# EAGLE design Adafruit Grayscale 1.5-inch 128x128 OLED (EAGLE 9.6.2)
COMPANY: ADAFRUIT INDUSTRIES; DRAWN: KTOWN; REV: A
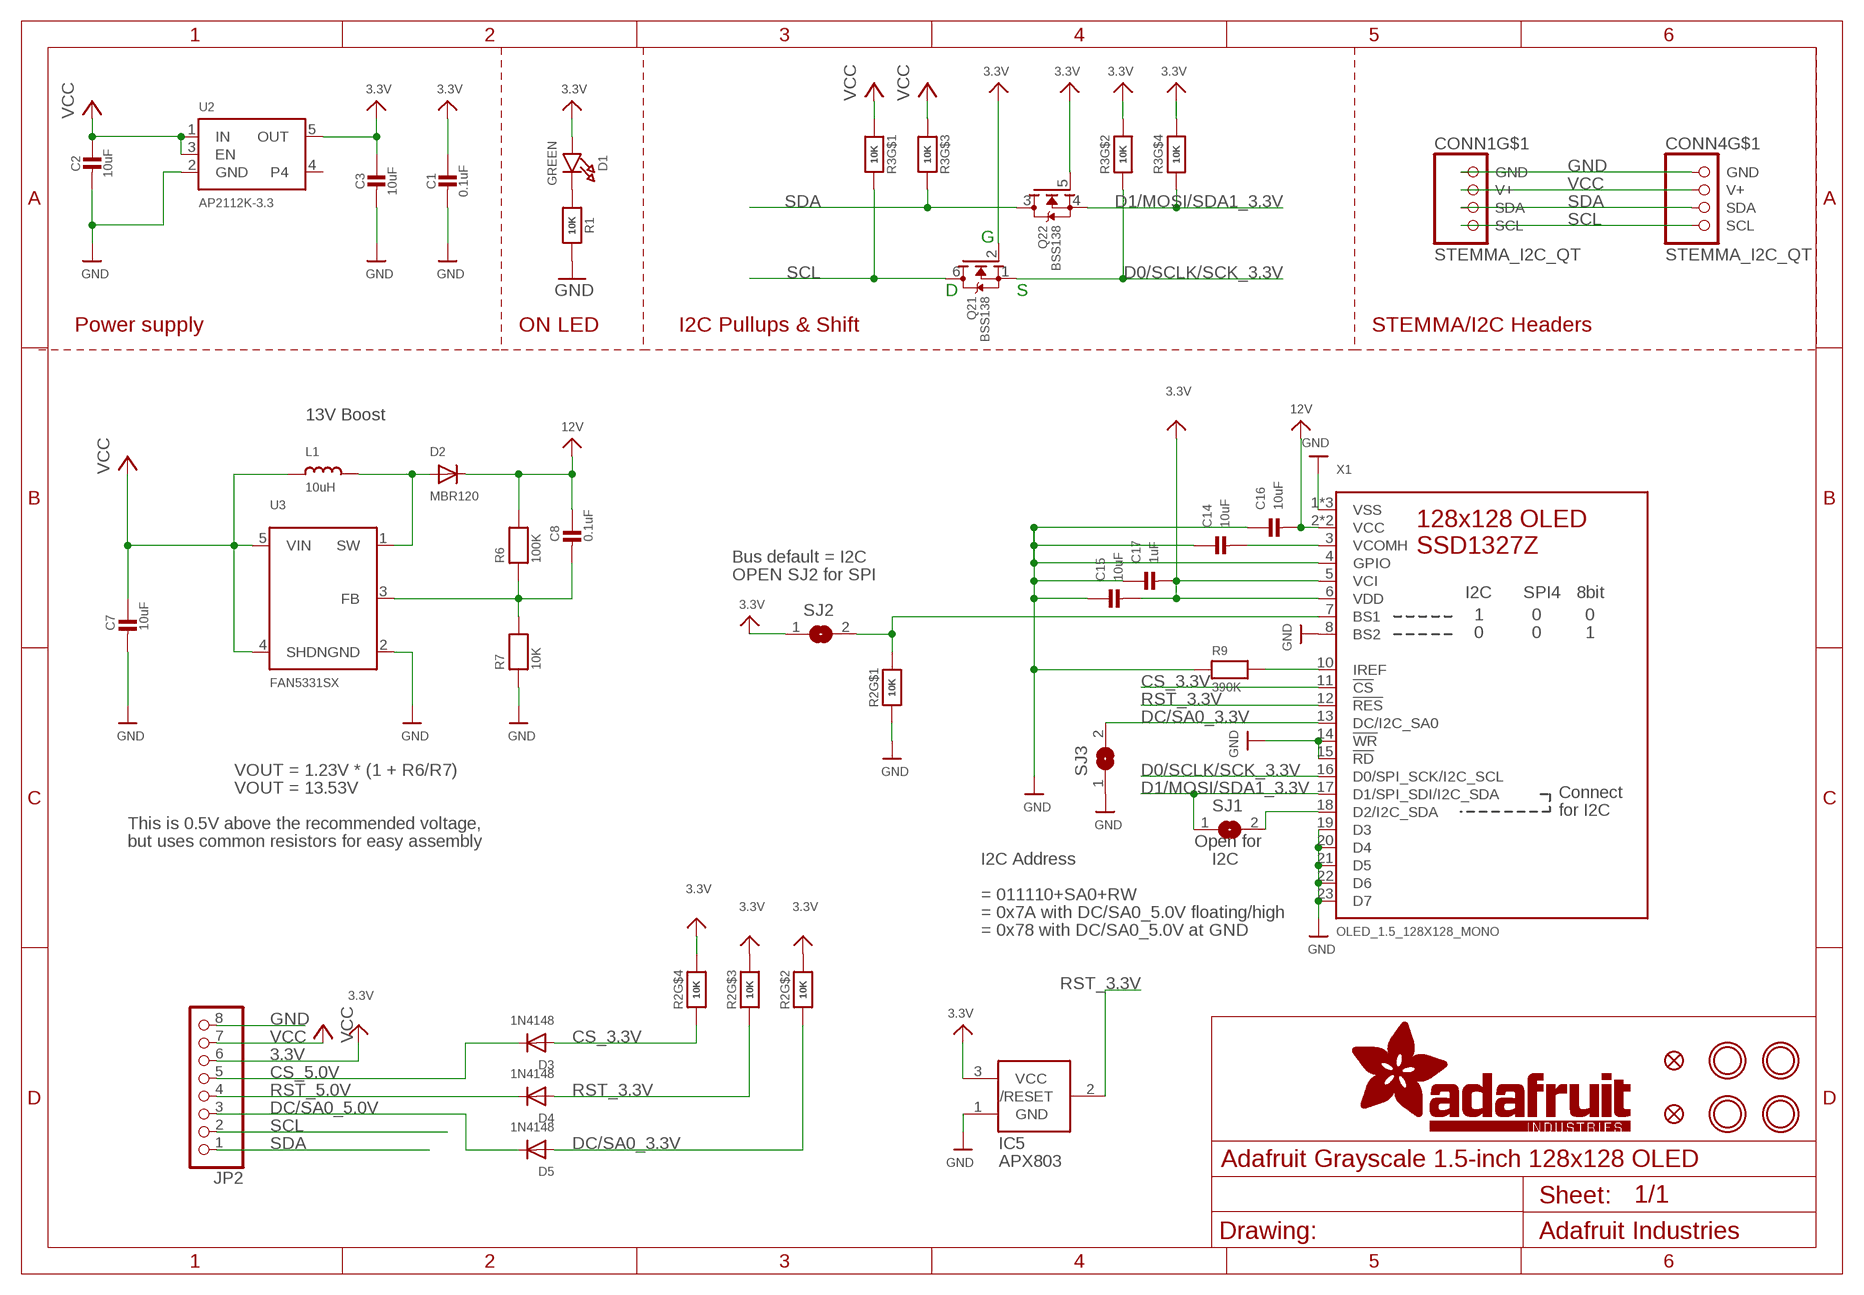
[diagram p0: schematic, sheet 1]

## Parts
C1  0.1uF  CAP_CERAMIC0603_NO  [0603-NO]
C2  10uF  CAP_CERAMIC0805-NOOUTLINE  [0805-NO]
C3  10uF  CAP_CERAMIC0805-NOOUTLINE  [0805-NO]
C7  10uF  CAP_CERAMIC0805-NOOUTLINE  [0805-NO]
C8  0.1uF  CAP_CERAMIC0603_NO  [0603-NO]
C14  10uF  CAP_CERAMIC0805-NOOUTLINE  [0805-NO]
C15  10uF  CAP_CERAMIC0805-NOOUTLINE  [0805-NO]
C16  10uF  CAP_CERAMIC0805-NOOUTLINE  [0805-NO]
C17  1uF  CAP_CERAMIC0603_NO  [0603-NO]
CONN1  STEMMA_I2C_QT  [JST_SH4]
CONN4  STEMMA_I2C_QT  [JST_SH4]
D1  GREEN  LED0603_NOOUTLINE  [CHIPLED_0603_NOOUTLINE]
D2  MBR120  DIODESOD-123  [SOD-123]
D3  1N4148  DIODESOD-323  [SOD-323]
D4  1N4148  DIODESOD-323  [SOD-323]
D5  1N4148  DIODESOD-323  [SOD-323]
FID3  FIDUCIAL_1MM  [FIDUCIAL_1MM]
FID4  FIDUCIAL_1MM  [FIDUCIAL_1MM]
IC5  APX803  AXP083-SAG  [SOT23]
JP2  HEADER-1X870MIL  [1X08_ROUND_70]
L1  10uH  INDUCTOR  [INDUCTOR_1007]
Q2  BSS138  MOSFET-N_DUAL  [SOT363]
R1  10K  RESISTOR_0603_NOOUT  [0603-NO]
R2  10K  RESISTOR_4PACK  [RESPACK_4X0603]
R3  10K  RESISTOR_4PACK  [RESPACK_4X0603]
R6  100K  RESISTOR_0603_NOOUT  [0603-NO]
R7  10K  RESISTOR_0603_NOOUT  [0603-NO]
R9  390K  RESISTOR_0603_NOOUT  [0603-NO]
SJ1  SOLDERJUMPERCLOSED  [SOLDERJUMPER_CLOSEDWIRE]
SJ2  SOLDERJUMPERCLOSED  [SOLDERJUMPER_CLOSEDWIRE]
SJ3  SOLDERJUMPER  [SOLDERJUMPER_ARROW_NOPASTE]
U2  AP2112K-3.3  VREG_SOT23-5  [SOT23-5]
U3  FAN5331SX  FAN5331  [SOT23-5@1]
U$1  MOUNTINGHOLE2.5  [MOUNTINGHOLE_2.5_PLATED]
U$17  MOUNTINGHOLE2.5  [MOUNTINGHOLE_2.5_PLATED]
U$19  MOUNTINGHOLE2.5  [MOUNTINGHOLE_2.5_PLATED]
U$21  MOUNTINGHOLE2.5  [MOUNTINGHOLE_2.5_PLATED]
X1  OLED_1.5_128X128_MONO  [OLED_1.5IN_128X128MONO]

## Nets
3.3V: C1.1 C3.1 C15.2 C17.2 D1.A IC5.3(VCC) JP2.6 Q2.2(1:G) Q2.5(2:G) R2.5 R2.6 R2.7 R3.2 R3.4 SJ2.1 U2.5(OUT) X1.5(VCI) X1.6(VDD)
12V: C8.1 C16.2 D2.C R6.2 X1.2(VCC) X1.24(VCC)
CS_3.3V: D3.A R2.4 X1.11(!CS)
CS_5.0V: D3.C JP2.5
D0/SCLK/SCK_3.3V: Q2.1(1:S) R3.7 X1.16(D0/SPI_SCK/I2C_SCL)
D1/MOSI/SDA1_3.3V: Q2.4(2:S) R3.5 SJ1.1 X1.17(D1/SPI_SDI/I2C_SDA)
DC/SA0_3.3V: D5.A R2.2 SJ3.2 X1.13(DC/I2C_SA0)
DC/SA0_5.0V: D5.C JP2.3
GND: C1.2 C2.2 C3.2 C7.2 C14.1 C15.1 C16.1 C17.1 CONN1.1(GND) CONN4.1(GND) IC5.1(GND) JP2.8 R1.2 R2.1 R7.1 R9.1 SJ3.1 U2.2(GND) U3.2(GND) X1.1(VSS) X1.4(GPIO) X1.8(BS2) X1.9(VSS) X1.14(!WR) X1.15(!RD) X1.19(D3) X1.20(D4) X1.21(D5) X1.22(D6) X1.23(D7) X1.25(VSS)
N$2: D1.C R1.1
N$5: D2.A L1.P$2 U3.1(SW)
N$8: C8.2 R6.1 R7.2 U3.3(FB)
N$9: R2.8 SJ2.2 X1.7(BS1)
N$10: R9.2 X1.10(IREF)
N$15: C14.2 X1.3(VCOMH)
N$17: SJ1.2 X1.18(D2/I2C_SDA)
RST_3.3V: D4.A IC5.2(/RESET) R2.3 X1.12(!RES)
RST_5.0V: D4.C JP2.4
SCL: CONN1.4(SCL) CONN4.4(SCL) JP2.2 Q2.6(1:D) R3.8
SDA: CONN1.3(SDA) CONN4.3(SDA) JP2.1 Q2.3(2:D) R3.6
VCC: C2.1 C7.1 CONN1.2(V+) CONN4.2(V+) JP2.7 L1.P$1 R3.1 R3.3 U2.1(IN) U2.3(EN) U3.4(SHDN) U3.5(VIN)
Unconnected: CONN1.MT1(MT) CONN1.MT2(MT) CONN4.MT1(MT) CONN4.MT2(MT) U2.4

## Notes on the sheet
- G
- D | S
- Power supply | ON LED | I2C Pullups & Shift | STEMMA/I2C Headers
- 13V Boost
- Bus default = I2C
- OPEN SJ2 for SPI
- VOUT = 1.23V * (1 + R6/R7)
- VOUT = 13.53V
- This is 0.5V above the recommended voltage,
- but uses common resistors for easy assembly | Open for
- I2C Address | I2C
- = 011110+SA0+RW
- = 0x7A with DC/SA0_5.0V floating/high
- = 0x78 with DC/SA0_5.0V at GND

## Library data of the parts
C1-C3 C7 C8 C14-C17 = microbuilder:CAP_CERAMIC: Ceramic Capacitors For new designs, use the packages preceded by an '_' character since they are more reliable: The following footprints should be used on most boards: _0402 - Standard footprint for regular board layouts _0603 - Standard footprint for regular board layouts _0805 - Standard footprint for regular board layouts _1206 - Standard footprint for regular board layouts For extremely tight-pitch boards where space is at a premium, the following 'micro-pitch' footprints can be used (smaller pads, no silkscreen outline, etc.): _0402MP - Micro-pitch footprint for very dense/compact boards _0603MP - Micro-pitch footprint for very dense/compact boards _0805MP - Micro-pitch footprint for very dense/compact boards _1206MP - Micro-pitch footprint for very dense/compact boards
CONN1 CONN4 = microbuilder:STEMMA_I2C
D1 = microbuilder:LED: LED 0603 - 0603 Surface Mount Package 2mA: Green LED - Low Power (3.9mcd, 2ma, 1.7Vf) - Digikey: 475-2709-2-ND Orange LED - Low Power (9.8mcd, 2ma, 1.8Vf) - Digikey: 475-1194-2-ND Red LED - Low Power (5mcd, 2ma, 1.8Vf) - Digikey: 475-1195-2-ND Yellow LED - Low Power (7mcd, 2ma, 1.8Vf) - Digikey: 475-1196-2-ND 5mA: Blue LED - Low Power (17mcd, 5ma, 2.9Vf) - Digikey: LNJ937W8CRACT-ND 0805 - 0805 Surface Mount Package 2mA: Red LED (8.8mcd, 2mA, 1.8Vf, Clear) - Low Power [Digikey: 475-2510-1-ND] Green LED (5mcd, 2mA, 1.8Vf, Clear) - Low Power [Digikey: 475-2730-1-ND] Yellow LED (11.3mcd, 2mA, 1.8Vf, Clear) - Low Power [Digikey: 475-2555-1-ND] 20mA: Red LED (104mcd, 20mA, Diffused) - LS R976 [Digikey: 475-1278-6-ND] Red LED (12mcd, 20mA, 2.0Vf, Clear) - APT2012EC [Digikey: 754-1128-1-ND] Green LED (15mcd, 20mA, 2.2Vf, Clear) - APT2012GC [Digikey: 754-1131-1-ND] Orange LED (160mcd, 20mA, 2.1Vf, Clear) - APT2012SECK [Digikey: 754-1130-1-ND] 1206 - 1206 Surface Mount Package Green LED (26mcd, 20mA, Diffused) - LG N971 [Digikey: 475-1407-6-ND] Red LED (15mcd, 20mA, Diffused) - LH N974 [Digikey: 475-1416-6-ND] Cree - Cree High-Power Surface Mount LEDs XPEBWT-L1-0000-00D50 - White 111lm 350mA 2.9Vf 6200K 110° XTEAWT-00-0000-00000LEE3 - White 114lm 350mA 2.85Vf 5000K 115° Everlight - Everlight 45-21 Series Surface Mount LEDs 45-21/QK2C-B2832AC2CB2/2T - Warm White 2000mcd 20mA 3.25Vf 3050K 120° 45-21/LK2C-B38452C4CB2/2T - Nuetral White 2000mcd 20mA 3.25Vf 4150K 120° 45-21/LK2C-B50634C6CB2/2T - Cold White 2200mcd 20mA 3.25Vf 5650K 120° PLCC2 Reverse Mount LS T77K-J1L2-1-0-2-R18-Z - Red 11.25mcd 2mA 1.8Vf 630nm 120° LO T77K-L1M2-24-Z - Orange 19.6mcd 2mA 1.8Vf 606nm 120° LY T77K-K2M1-26-Z - Yellow 15.7mcd 2mA 1.8Vf 587nm 120°
D2-D5 = microbuilder:DIODE: Diode SMA Model Volts Amps Type Vf Ir Digikey # Notes SSA34-E3 40V 3A Schottky 480mV @ 3A 200uA @ 40V SSA34-E3/61TGITR-ND CDBA120-G 20V 1A Schottky 500mV @ 1A 500uA @ 20V 641-1014-6-ND REEL MBRA210 10V 2A Schottky 350mV @ 2A 700uA @ 10V MBRA210LT3 SOD-123 Model Volts Amps Type Vf Ir Order # Notes BAT54T1G 30V 200mA Schottky 800mV @ 200mA 2uA @ 25V BAT54T1GOSTR-ND B0530W 30V 500mA Schottky 430mV @ 500mA 130uA @ 30V B0530W-FDICT-ND REEL MBR120 20V 1A Schottky 340mV @ 1A MBR120VLSFT1GOSCT-ND SOD-323 Model Volts Amps Type Vf Ir Order # Notes PMEG2005EJ 20V 500mA Schottky 355mV @ 500mA 568-4110-1-ND ZLLS410 10V 570mA Schottky 380mV @ 570mA ZLLS410CT-ND 1N4148WS 75V 150mA Silicon/Simple 1V 1N4148WSFSCT-ND REEL SOD-523 Model Volts Amps Type Vf Ir Order # Notes BAT54XV2 30V 200mA Schottky 0.8V @ 100mA BAT54XV2CT-ND TB751S 30V 30mA Schottky RB751S-40TE61CT-ND SOT23-R/W (R = Solder Paste/Reflow Ovens, W = Hand-Soldering) Model Volts Amps Type Vf Ir Order # Notes BAT54FILM 40V 300mA Schottky 497-7162-1-ND POWERDI-5 Model Volts Amps Type Vf Ir Order # Notes PDS560 60V 5A Schottky 670mV @ 5A 150uA @ 60V PDS560DICT-ND
FID3 FID4 = microbuilder:FIDUCIAL: Fiducial Alignment Points Various fiducial points for machine vision alignment.; BOM: EXCLUDE
IC5 = adafruit:AXP083
JP2 = microbuilder:HEADER-1X8: PIN HEADER
L1 = microbuilder:INDUCTOR: Inductors 0603: 10nH Ceramic Inductor - microwire antenna/RF (Digikey: 712-1434-2-ND) 0805: 560nH Ceramic Inductor - RF (Digikey: 553-1047-1-ND) 270nH Ceramic Inductor - Q = 40@250MHz, +-5%, 1 Ohm DC Resistance (Digikey: 535-10506-2-ND) 1007 (2518 Metric) SMT: 10µH 10% 250mOhm 820mA 1007 Inductor (Digikey: 587-2189-1-ND) 22µH 10% 500mOhm 580mA 1007 Inductor (Digikey: 587-2190-1-ND) 47µH 10% 950mOhm 420mA 1007 Inductor (Digikey: 587-2191-1-ND) 47µH 5% 100mOhm 1A 1008 Inductor (Digikey: 732-1816-1-ND) 5.0x5.0mm (Taiyo Yuden NR5040 Series) 6.8µH 20% 2.3A 64mOhm Inductor (Digikey: 587-2374-2-ND) 5.0x5.0mm (TDK VLC5045 Series) 4.7µH 20% 3.3A 34mOhm Inductor (Digikey: 445-6526-1-ND) 6.8µH 20% 2.7A 46mOhm Inductor (Digikey: 445-6527-1-ND) 6.0x6.0mm (TDK VLC6045 Series) 4.7µH 20% 3.8A 27mOhm Inductor (Digikey: 445-6538-2-ND) 6.8µH 20% 3A 41mOhm Inductor (Digikey: 445-6540-1-ND) 6.2µH 30% 2.2A 45mOhm Inductor (Digikey: SRR5028-6R2YCT-ND) - Not TDK VLC6045 but footprint should match 6.0x6.0mm (TDK SLF6045 Series) 6.8uH 30% 2A 33mOhm Inductor (Digikey: 445-4572-1-ND, Mouser: 810-SLF645T6R8N2R0PF) 6.0x6.0mm (Sumida CDRH5D28 Series) 6.2uH 30% 1.8A 45mOhm Inductor (Digikey: 308-1542-1-ND) Taiyo Yuden NR3015T2R2M - 2.2uH 20% 1.5A (Digikey: 587-1648-2-ND, Mouser: 963-NR3015T2R2M) - Used with TI TPS62172 CoilCraft RFID Transponder Coil - MA5532-AE (For use with AS3935 Lightning Sensor) Taiyo Yuden NRH2412T2R2MNGH - 2.2uH 20% 1AA (Digikey: 587-3443-1-ND) - Used with TI LM3671 Vishay IHLP 1.0uH Molded Inductor - 24mOhm DCR, 5A, +/-20%, -55°C-125°C (Digikey: 541-1319-1-ND)
Q2 = microbuilder:MOSFET-N_DUAL: Dual N-Channel MOSFET SOT363 (2.0x1.25mm) 2N7002PS - 60V, 320mA [Digikey: 568-5984-1-ND]
R1 R6 R7 R9 = microbuilder:RESISTOR: Resistors For new designs, use the packages preceded by an '_' character since they are more reliable: The following footprints should be used on most boards: _0402 - Standard footprint for regular board layouts _0603 - Standard footprint for regular board layouts _0805 - Standard footprint for regular board layouts _1206 - Standard footprint for regular board layouts For extremely tight-pitch boards where space is at a premium, the following 'micro-pitch' footprints can be used (smaller pads, no silkscreen outline, etc.): _0402MP - Micro-pitch footprint for very dense/compact boards _0603MP - Micro-pitch footprint for very dense/compact boards _0805MP - Micro-pitch footprint for very dense/compact boards _1206MP - Micro-pitch footprint for very dense/compact boards
R2 R3 = microbuilder:RESISTOR_4PACK: Resistor Packs (4 resistors) 4 x 0603 10K 1/16W - Digikey: YC164J-10KCT-ND
SJ1 SJ2 = microbuilder:SOLDERJUMPER: SMD Solder JUMPER Solder the two pads together to create a connection, or remove the solder to break it. REFLOW - Use this footprint for solder paste and reflow ovens. WAVE - Use this footprint for hand-soldering (larger pads). CLOSED - Has a trace between the two pads to ensure it is closed by default. The trace needs to be cut to disable the jumper, and can be closed again by creating a solder bridge between the two pads.
SJ3 = microbuilder:SOLDERJUMPER: SMD Solder JUMPER Solder the two pads together to create a connection, or remove the solder to break it. REFLOW - Use this footprint for solder paste and reflow ovens. WAVE - Use this footprint for hand-soldering (larger pads). CLOSED - Has a trace between the two pads to ensure it is closed by default. The trace needs to be cut to disable the jumper, and can be closed again by creating a solder bridge between the two pads.; BOM: EXCLUDE
U2 = microbuilder:VREG_SOT23-5: SOT23-5 Fixed Voltage Regulators Part Current Out V Out V In V Dropout θJA (°C/W) TJ (°C) Digikey Part No. ADP121 150mA 3.3V 3.4-5.5V 0.09V @ 150mA -- -- ADP121-AUJZ33R7CT-ND ADP121 150mA 3.0V 3.1-5.5V 0.09V @ 150mA -- -- ADP121-AUJZ30R7CT-ND ADP122 300mA 3.3V 3.4-5.5V 0.085V @ 300mA -- -- ADP122AUJZ-3.3-R7CT-ND ADP1712 300mA 3.3V 3.5-5.5V 0.17V @ 300mA -- -- ADP1712AUJZ-3.3-R7TR-ND AP7311 (Low Cost) 150mA 3.3V 3.5-6V 0.15V @ 150mA -- -- AP7311-33WG-7DICT-ND LD39015M18R 150mA 1.8V 1.9V-5.5V 0.08V @ 100mA -- -- 497-6977-1-ND LP2985A-33DBVR 150mA 3.3V 3.3-16V 0.28V @ 150mA 206 150 296-18479-1-ND MCP1824T-3302E/OT 300mA 3.3V 3.5V-6V 0.2V @ 300mA -- -- MCP1824T-3302E/OTCT-ND MIC5205-2.5YM5 TR 150mA 2.5V 2.7-16V 0.165V @ 150mA -- -- 576-1257-2-ND MIC5205-3.0YM5 TR 150mA 3.0V 3.2V-16V 0.165V @ 150mA -- -- 576-1258-2-ND MIC5205-3.3YM5 TR 150mA 3.3V 3.5V-16V 0.165V @ 150mA -- -- 576-1259-2-ND TPS780330220 150mA 3.3V+2.2V 3.6-5.5V 250mV Max -- -- 296-23332-1-ND TDA3663/N1,135 100mA 3.3V 3.5-45V 0.18V @ 50mA -- -- 568-5343-1-ND Max operating temp can be calculated using θJA, TJ (max junction temperature), and power in watts. Set the "Maximum Ambient Temperature" until it reaches TJ ("Max Junction Temperature"), which is the absolute limit for safe use of the regulator: Heat Sink Temperature Calculator <http://www.daycounter.com/Calculators/Heat-Sink-Temperature-Calculator.phtml> For example, With 12V source into a 3.3V LP2985 and a 30mA load, we are dissipating (12V-3.3V) * 0.03A = 0.261W. With a θJA of 206 °C/W, a TJ of 150°C, and 261mW we can safely use the chip without a heat sink up to 75°C (=147.1°C Junction Temperature).
U3 = microbuilder:FAN5331: FAN5331 - LED/OLED 20V Boost Converter Digikey: FAN5331SXCT-ND
U$1 U$17 U$19 U$21 = microbuilder:MOUNTINGHOLE: Mounting Hole For #2 screws (0.086"/2.18mm width, 0.094"/2.4mm hole) use 2.5mm; BOM: EXCLUDE
X1 = adafruit_display:OLED_1.5_128X128_MONO

## Board
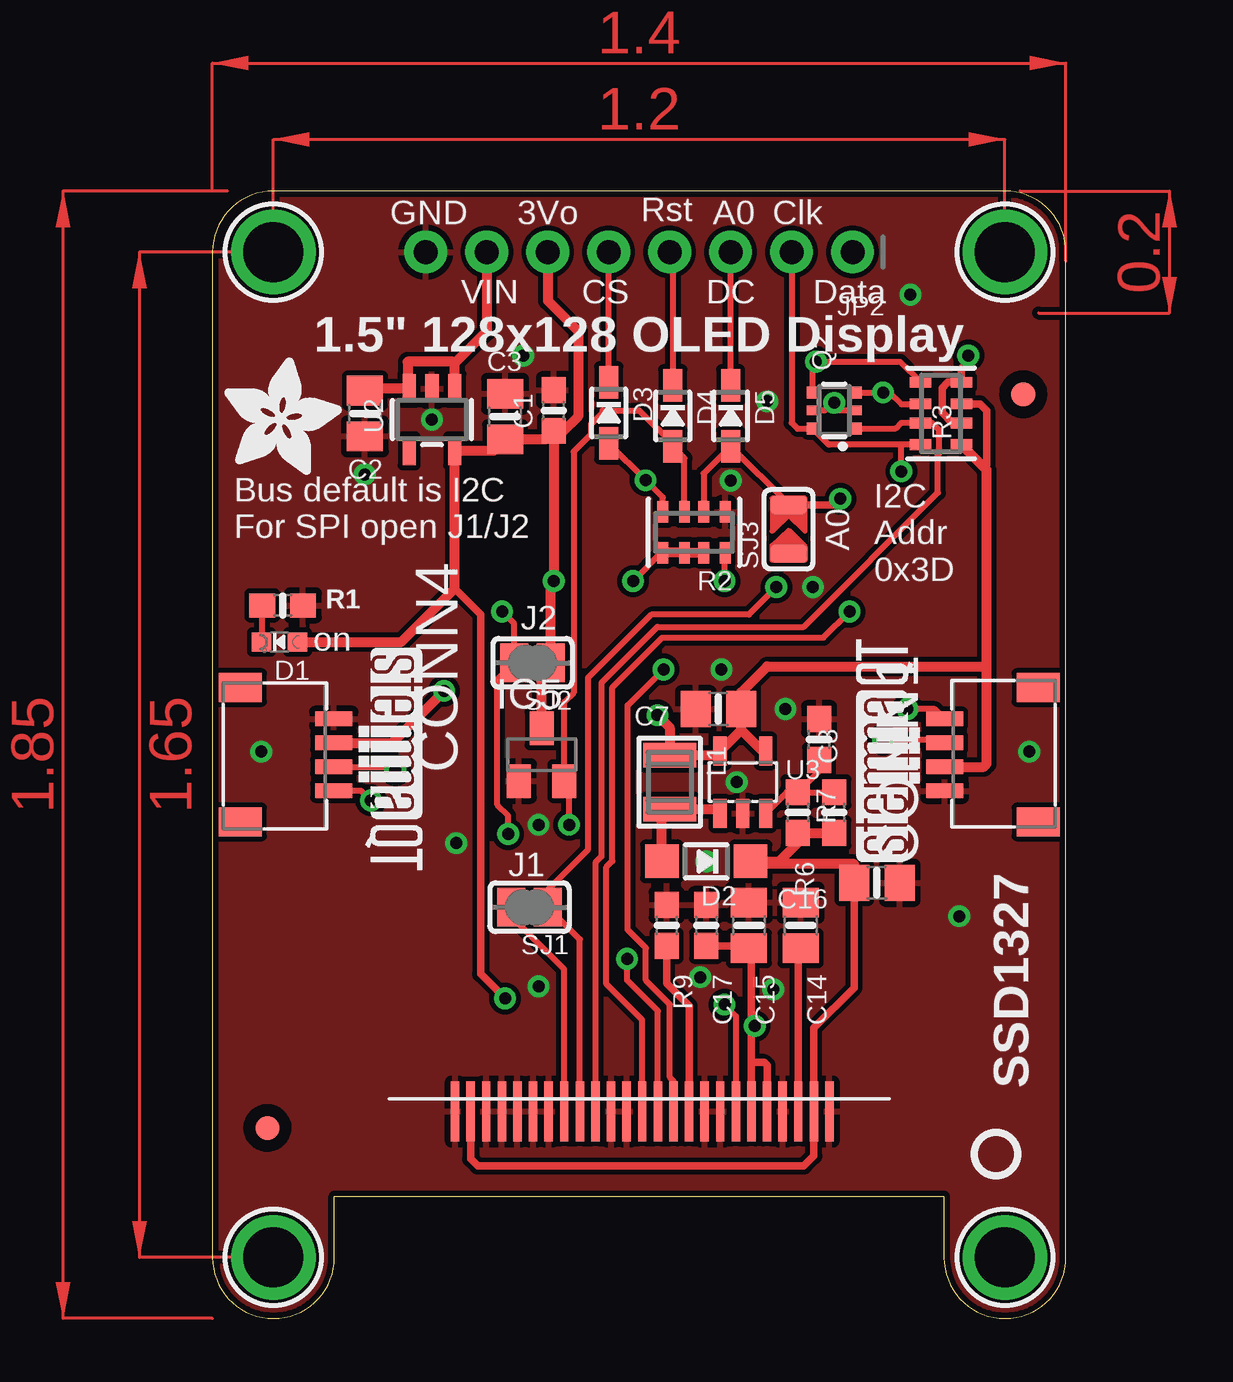
[diagram p1: board, top side]
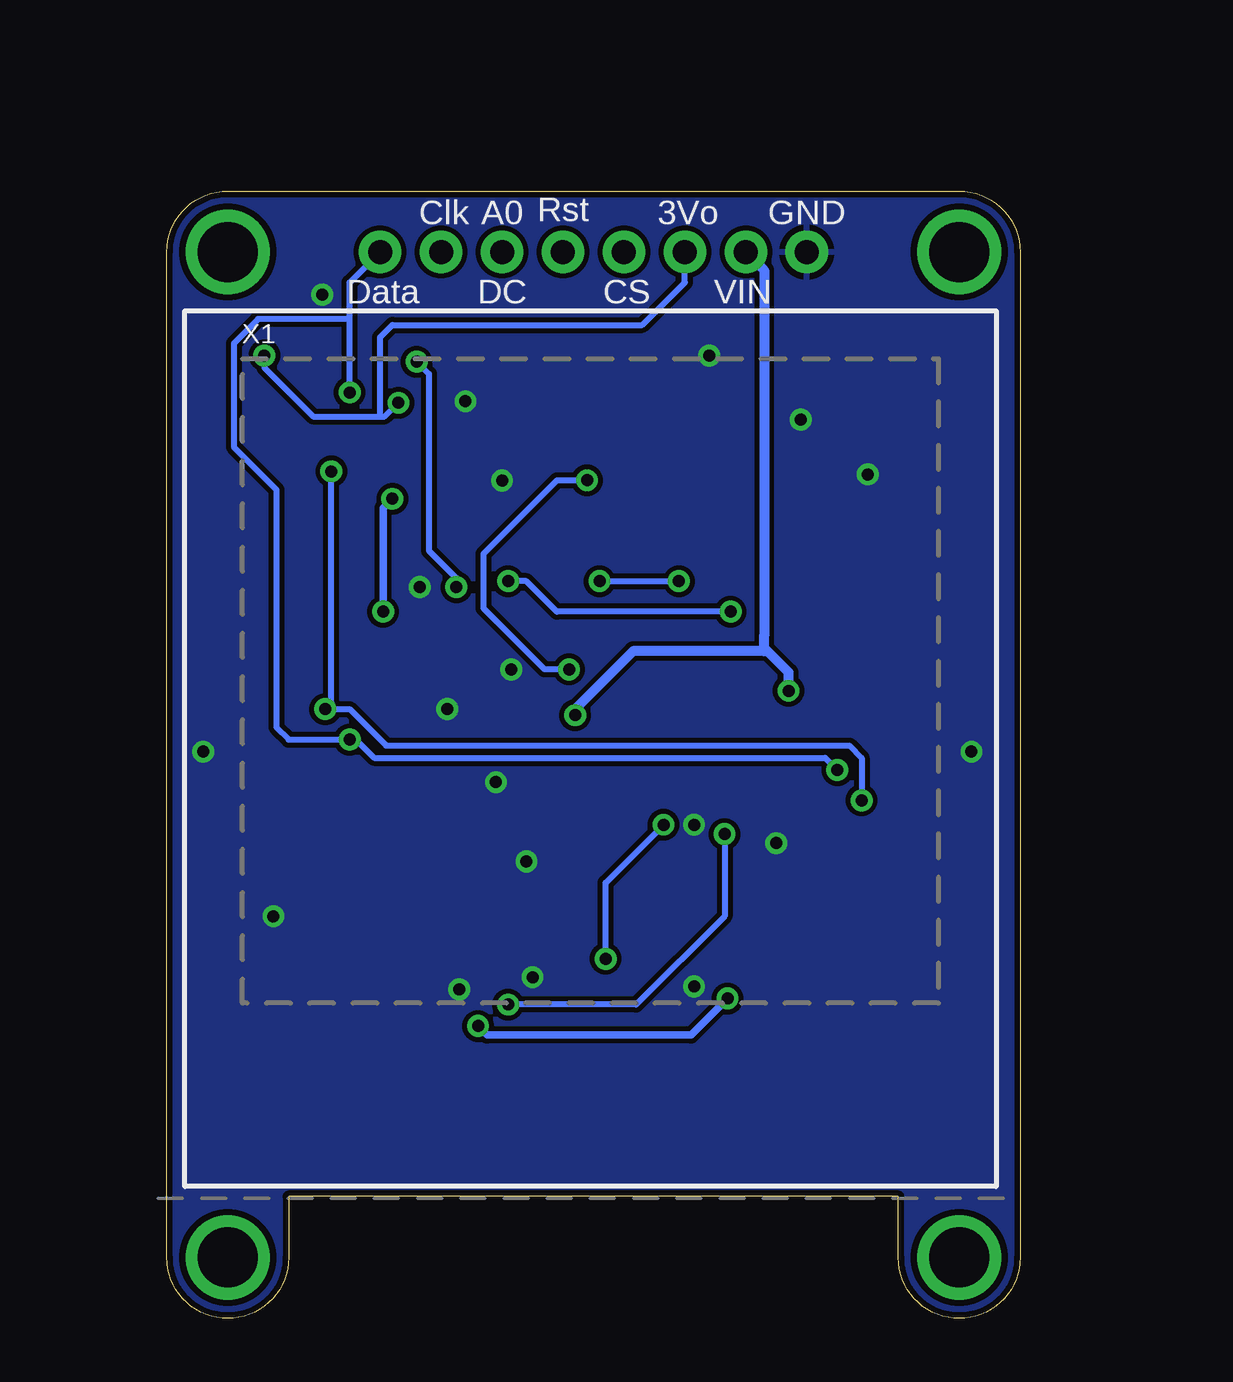
[diagram p2: board, bottom side, seen from below]

Size 35.56 x 46.99 mm. Coordinates in mm from the lower left corner, seen from the top.
Outline: 0,44.45 0,2.54 arc90 2.54,0 arc90 5.08,2.54 5.08,5.08 30.48,5.08 30.48,2.54 arc90 33.02,0 arc90 35.56,2.54 35.56,44.45 arc90 33.02,46.99 2.54,46.99 arc90 0,44.45
Copper layers (1*16): Top 0.035mm / dielectric 1.5mm / Bottom 0.035mm
Design rules "adafruit *": minimum track width 8mil, minimum drill 15.5mil, track to track 8mil, track to pad 8mil, pad to pad 8mil, via to via 8mil, smd to smd 8mil, copper to edge 10mil, drill to drill 8mil, minimum pad ring 10mil, minimum via ring 8mil, stop-mask expansion 2mil, vias tented up to drill 20mil, thermal gap 10mil

### Footprints (pad centres in the part's own frame; a part is rotated, then mirrored left to right if it is on the bottom)
0603-NO = smd 1.075 x 1: 1 -0.85,0; 2 0.85,0
0805-NO = smd 1.24 x 1.5: 1 -0.95,0; 2 0.95,0
JST_SH4 = smd 0.6 x 1.55: 1 -1.5,2.514; 2 -0.5,2.514; 3 0.5,2.514; 4 1.5,2.514 | smd 1.2 x 1.8: MT1 -2.8,-1.386; MT2 2.8,-1.386
CHIPLED_0603_NOOUTLINE = smd 0.8 x 0.8: A 0,-0.75; C 0,0.75
SOD-123 = smd 1.4 x 1.4: A 1.85,0; C -1.85,0
SOD-323 = smd 1.35 x 0.8: A 1.27,0; C -1.27,0
FIDUCIAL_1MM = smd 1 x 1: 1 0,0
SOT23 = smd 1 x 1.4: 1 -0.95,-1.1; 2 0.95,-1.1; 3 0,1.1
1X08_ROUND_70 = drill 1 pad 1.778: 1 -8.89,0; 2 -6.35,0; 3 -3.81,0; 4 -1.27,0; 5 1.27,0; 6 3.81,0; 7 6.35,0; 8 8.89,0
INDUCTOR_1007 = smd 1.016 x 2.2: P$1 -1.127,0; P$2 1.127,0
SOT363 = smd 0.5 x 0.5: 1 -0.75,-0.9; 3 0.75,-0.9; 4 0.75,0.9; 6 -0.75,0.9 | smd 0.4 x 0.5: 2 0,-0.9; 5 0,0.9
RESPACK_4X0603 = smd 0.45 x 0.9: 1 -1.3,-0.85; 2 -0.4,-0.85; 3 0.4,-0.85; 4 1.3,-0.85; 5 1.3,0.85; 6 0.4,0.85; 7 -0.4,0.85; 8 -1.3,0.85
SOLDERJUMPER_CLOSEDWIRE = smd 1.168 x 1.6: 1 -0.762,0; 2 0.762,0 | smd 0.635 x 0.203: WIRE 0,0
SOLDERJUMPER_ARROW_NOPASTE = smd 0.762 x 1.524: 1 -1.016,0; 2 1.016,0
SOT23-5 = smd 0.55 x 1.2: 1 -0.95,-1.3; 2 0,-1.3; 3 0.95,-1.3; 4 0.95,1.3; 5 -0.95,1.3
SOT23-5@1 = smd 0.55 x 1.2: 1 -0.95,-1.3; 2 0,-1.3; 3 0.95,-1.3; 4 0.95,1.3; 5 -0.95,1.3
MOUNTINGHOLE_2.5_PLATED = drill 2.5 pad 3.2: P$1 0,0
OLED_1.5IN_128X128MONO = smd 0.35 x 2.5 bottom: 1 -7.8,-15.125; 2 -7.15,-15.125; 3 -6.5,-15.125; 4 -5.85,-15.125; 5 -5.2,-15.125; 6 -4.55,-15.125; 7 -3.9,-15.125; 8 -3.25,-15.125; 9 -2.6,-15.125; 10 -1.95,-15.125; 11 -1.3,-15.125; 12 -0.65,-15.125; 13 0,-15.125; 14 0.65,-15.125; 15 1.3,-15.125; 16 1.95,-15.125; 17 2.6,-15.125; 18 3.25,-15.125; 19 3.9,-15.125; 20 4.55,-15.125; 21 5.2,-15.125; 22 5.85,-15.125; 23 6.5,-15.125; 24 7.15,-15.125; 25 7.8,-15.125

### Placement (x,y rotation side)
C1  14.22,37.85 90 top
C2  6.35,37.72 270 top
C3  12.19,37.59 90 top
C7  21.08,25.4 180 top
C8  25.91,21.08 90 top
C14  24.51,16.38 270 top
C15  22.35,16.38 270 top
C16  27.69,18.16 180 top
C17  20.57,16.38 270 top
CONN1  33.02,23.49 90 top
CONN4  2.54,23.49 270 top
D1  2.79,28.19 90 top
D2  20.57,19.05 180 top
D3  16.51,37.74 270 top
D4  19.18,37.62 270 top
D5  21.59,37.62 270 top
FID3  2.29,7.94 0 top
FID4  33.78,38.52 0 top
IC5  13.72,23.49 0 top
JP2  17.78,44.45 180 top
L1  19.05,22.35 270 top
Q2  25.91,37.85 90 top
R1  2.92,29.72 0 top
R2  20.07,32.77 180 top
R3  30.35,37.72 90 top
R6  24.38,21.08 270 top
R7  25.27,24.13 270 top
R9  18.92,16.38 270 top
SJ1  13.21,17.14 180 top
SJ2  13.34,27.33 180 top
SJ3  24,32.89 90 top
U2  9.14,37.46 180 top
U3  22.1,22.35 0 top
U$1  2.54,44.45 0 top
U$8  [ADAFRUIT_5MM]  0.51,35.18 0 top
U$17  33.02,44.45 0 top
U$19  2.54,2.54 0 top
U$20  [STEMMAQT]  29.46,19.05 90 top
U$21  33.02,2.54 0 top
U$25  [PCBFEAT-REV-040]  32.64,6.86 0 top
U$31  [STEMMAQT]  6.1,27.94 270 top
X1  17.91,23.75 0 bottom

### Tracks (layer width: path | path; a pad name or v marks a point on that pad's centre or on a via)
3.3V  (via drill 0.5)
  Top 0.254: Q2.5 25.52,37.85 25.83,38.16 v25.91,38.16 25.91,37.98 26.05,37.85 Q2.2 | 31.6,39.99 31.5,40.09 v31.5,40.13 | R2.5 18.71,31.92 v17.53,30.73
  Top 0.305: R3.2 30.82,37.32 30.4,37.75 30.4,38.78 30.64,39.02 R3.4 31.2,39.59 31.6,39.99 | 10.09,30.41 11.18,29.33 11.18,14.35 v12.19,13.34 | X1.6 22.46,10.67 | 22.46,10.67 22.46,12.32 | 22.46,12.32 22.46,15.33 C15.2 22.25,15.53 C17.2 | X1.5 23.11,10.55 22.99,10.67 22.46,10.67 | v22.59,12.19 v22.58,12.19 22.46,12.32
  Top 0.406: C1.1 13.87,36.64 C3.1 11.71,36.16 U2.5 10.09,30.41 7.87,28.19 D1.A | C1.1 14.31,36.91 14.56,36.91 15.24,37.59 15.24,41.15 13.97,42.42 JP2.6 | R2.7 R2.6 R2.5 | C1.1 v14.22,30.73 14.1,30.61 SJ2.1 14.06,27.29 14.06,27.06 13.72,26.72 IC5.3
  Bottom 0.254: 26.67,37.59 29.46,37.59 31.5,39.62 v31.5,40.13 | 26.67,37.59 26.48,37.59 v25.91,38.16 | v17.53,30.73 v14.22,30.73 | 26.67,37.59 26.67,40.89 26.16,41.4 15.75,41.4 13.97,43.18 JP2.6
  Bottom 0.305: v12.19,13.34 13.72,11.81 22.21,11.81 v22.59,12.19
12V
  Top 0.305: C16.2 26.74,13.78 25.06,12.1 25.06,9.53 X1.2 25.06,6.77 24.64,6.35 11.05,6.35 10.76,6.64 X1.24
  Top 0.406: C8.1 R6.2 24.38,19.81 23.62,19.05 D2.C 22.54,18.93 26.74,18.93 C16.2
CS_3.3V  (via drill 0.5)
  Top 0.254: R2.4 18.77,34.22 v18.05,34.94 D3.A | X1.11 19.21,9.89 19.06,10.04 19.06,13.08 18.05,14.09 18.05,15.44 17.3,16.2 17.3,25.55 v18.8,27.05
  Bottom 0.254: v18.8,27.05 19.81,27.05 22.35,29.59 22.35,31.88 19.29,34.94 v18.05,34.94
CS_5.0V
  Top 0.254: D3.C JP2.5
D0/SCLK/SCK_3.3V
  Top 0.254: Q2.1 28.46,37.1 28.7,37.34 29.48,37.34 R3.7 29.52,37.34 29.97,37.34 30.28,37.03 30.28,36.06 30.23,36 30.23,34.42 24.64,28.83 18.54,28.83 16.2,26.49 16.2,19.25 15.96,19.01 X1.16
D1/MOSI/SDA1_3.3V  (via drill 0.5)
  Top 0.254: Q2.4 25.01,39.74 v25.15,39.88 28.64,39.88 R3.5 | v23.5,30.48 22.35,29.34 18.29,29.34 15.65,26.7 15.65,19.53 13.97,17.86 SJ1.1 15.31,15.8 X1.17
  Bottom 0.254: v23.5,30.48 23.5,30.86 24.64,32 24.64,39.37 v25.15,39.88
DC/SA0_3.3V  (via drill 0.5)
  Top 0.254: R2.2 20.47,35.22 D5.A 24,33.93 SJ3.2 | X1.13 17.91,12.45 16.41,13.94 16.41,18.82 16.66,19.06 16.66,26.3 18.73,28.37 23.44,28.37 25.45,28.37 v26.54,29.46
  Top 0.305: v26.16,34.16 25.91,33.91 SJ3.2
  Bottom 0.305: v26.54,29.46 26.54,33.78 v26.16,34.16
DC/SA0_5.0V
  Top 0.254: D5.C JP2.3
GND  (via drill 0.5)
  other vias: 10.16,19.81 13.59,20.57 2.03,23.62 34.04,23.62 31.11,16.76 21.84,22.35 23.88,25.4 25.02,30.48 21.59,34.92 23.11,38.23 29.08,42.67 6.35,35.18 9.14,37.46 12.95,40.13 21.21,27.05 20.57,19.05 23.37,13.72 20.32,14.22 13.59,13.84
  pour Top: 0,46.99 35.56,46.99 35.56,0 0,0
  pour Bottom: 0,46.99 35.56,46.99 35.56,0 0,0
N$2
  Top 0.254: R1.1 2.04,29.36 D1.C
N$5
  Top 0.406: U3.1 20.98,21.23 L1.P$2 18.72,20.9 D2.A
N$8
  Top 0.254: R7.2 25.27,22.82 R6.1 | R6.1 C8.2 | U3.3 23.93,21.93 R6.1
N$9  (via drill 0.5)
  Top 0.254: v12.32,20.19 12.32,20.95 11.87,21.4 11.87,26.62 SJ2.2 12.57,28.96 v12.06,29.46 | v21.34,30.73 21.34,31.89 R2.8 | v21.34,13.08 21.81,12.61 X1.7
  Bottom 0.254: v21.34,30.73 20.57,30.73 19.3,29.46 v12.06,29.46 | v12.32,20.19 12.32,16.76 16,13.08 v21.34,13.08
N$10
  Top 0.305: X1.10 19.86,13.04 18.92,13.97 R9.2
N$15
  Top 0.305: X1.3 24.41,15.33 C14.2
N$17
  Top 0.254: X1.18 14.66,14.55 12.45,16.76 SJ1.2
RST_3.3V  (via drill 0.5)
  Top 0.254: R2.3 19.67,35.86 19.25,36.27 | 19.25,36.27 D4.A | 19.25,36.27 19.25,36.37 17.78,37.85 16.26,37.85 16.26,37.76 15.78,37.29 15.78,36.86 15.05,36.13 15.05,26.08 14.67,25.7 IC5.2 14.86,22.2 v14.86,20.57 | X1.12 18.56,12.81 17.27,14.1 v17.27,14.99
  Bottom 0.254: v17.27,14.99 17.27,18.16 v14.86,20.57
RST_5.0V
  Top 0.254: JP2.4 19.18,44.32 D4.C
SCL  (via drill 0.5)
  Top 0.254: R3.8 28.7,36.42 | 28.7,36.42 25.68,36.42 Q2.6 25,37.08 24.38,37.08 24.13,37.34 JP2.2 | CONN1.4 30.1,25.4 v28.96,25.4 | v6.6,21.59 6.2,21.99 CONN4.4 | v28.7,35.31 28.7,36.42
  Bottom 0.254: v6.6,21.59 6.6,23.37 7.11,23.88 26.42,23.88 27.94,25.4 v28.96,25.4 28.7,25.65 v28.7,35.31
SDA  (via drill 0.5)
  Top 0.254: Q2.3 v27.94,38.6 28.21,38.6 28.7,38.1 29.48,38.1 R3.6 | CONN4.3 7.49,22.99 v7.62,22.86 | v27.94,24.13 30.37,24.13 CONN1.3
  Bottom 0.254: v7.62,22.86 8.13,23.37 26.92,23.37 27.69,24.13 v27.94,24.13 30.48,24.13 30.99,24.64 30.99,34.54 32.77,36.32 32.77,40.64 31.75,41.66 27.94,41.66 | v27.94,38.6 27.94,41.66 | 27.94,41.66 27.94,43.18 JP2.1
VCC  (via drill 0.5)
  Top 0.305: R3.3 31.98,38.12 32.26,37.85 32.26,35.56 32.16,35.46
  Top 0.406: JP2.7 11.43,41.15 10.09,39.81 | U2.1 10.09,39.81 | 10.09,39.81 10.03,39.88 8.13,39.88 8.13,38.83 U2.3 6.45,38.77 C2.1 | 22.03,24.54 U3.5 20.98,23.48 L1.P$1 19.05,24.64 v18.54,25.15 | 22.03,24.54 C7.1 22.03,26.1 23.11,27.18 32.26,27.18 | U3.4 22.92,23.65 22.03,24.54 | CONN4.2 7.49,23.99 v9.65,26.16 | CONN1.2 32.14,22.99 32.26,23.11 32.26,27.18 | R3.1 32.16,35.46 32.26,35.36 32.26,27.18
  Bottom 0.406: v9.65,26.16 9.65,26.92 10.67,27.94 | 10.67,27.94 10.67,28.45 10.67,43.69 JP2.7 | 10.67,27.94 10.67,27.81 16.13,27.81 18.54,25.4 v18.54,25.15
(copper drawn outside any net)
  shapes: Top area x5

### Text on the board
tPlace: GND | 3Vo | Rst | A0 | Clk | VIN | CS | DC | Data | 1.5" 128x128 OLED Display | Bus default is I2C / For SPI open J1/J2 | A0 | I2C / Addr / 0x3D | J2 | on | J1 | SSD1327
bPlace: GND | 3Vo | Rst | A0 | Clk | VIN | CS | DC | Data